# Altium schematic sheet HCI.SchDoc
size A4
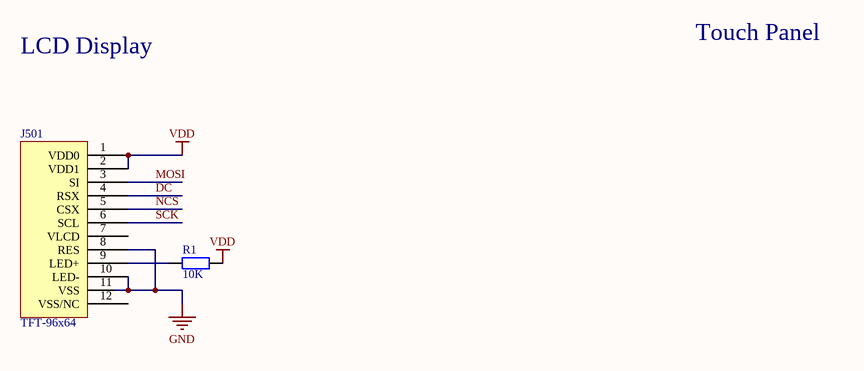
[diagram p0: HCI.SchDoc]

## Parts
J501  TFT-96x64  [TFT-PIN12-0.5]
R1  10K  [0603M]

## Nets
GND: J501.8(RES) J501.10(LED-) J501.11(VSS)
VDD: J501.1(VDD0) J501.2(VDD1) R1.2
DC: J501.4(RSX)
MOSI: J501.3(SI)
NCS: J501.5(CSX)
SCK: J501.6(SCL)
NetJ501_9: J501.9(LED+) R1.1

Not connected (* = marked no-connect by the designer): J501 7(VLCD) 12(VSS/NC)

## Notes on the sheet
- LCD Display
- Touch Panel

## Library data of the parts
R1 = Res2: Resistor; Published: 8-Jun-2000; LatestRevisionDate: 17-Jul-2002; LatestRevisionNote: Re-released for DXP Platform.; PackageReference: AXIAL-0.4; Publisher: Altium Limited; Value: 10K